# Altium schematic sheet Sheet1.SchDoc
size 420 x 297 mm; Address1: Address1; Address2: Address2; Address3: Address3; Address4: Address4; SheetNumber: 1; Scale: 1:1; Разраб.: Иванов; Обозначение документа: АБВГ.123456.001 Э3; Пров.: Петров; Утв.: Сидоров; Наименование организации: ОАО "Концерн "МПО-Гидроприбор"; Перв. применение: АБВГ.123456.000; Наименование изделия 1: Плата; Наименование изделия 2: Схема электрическая; Наименование изделия 3: принципиальная; Нач. отд.: Нач. отд.; Фамилия нач. отд.: Сидоров
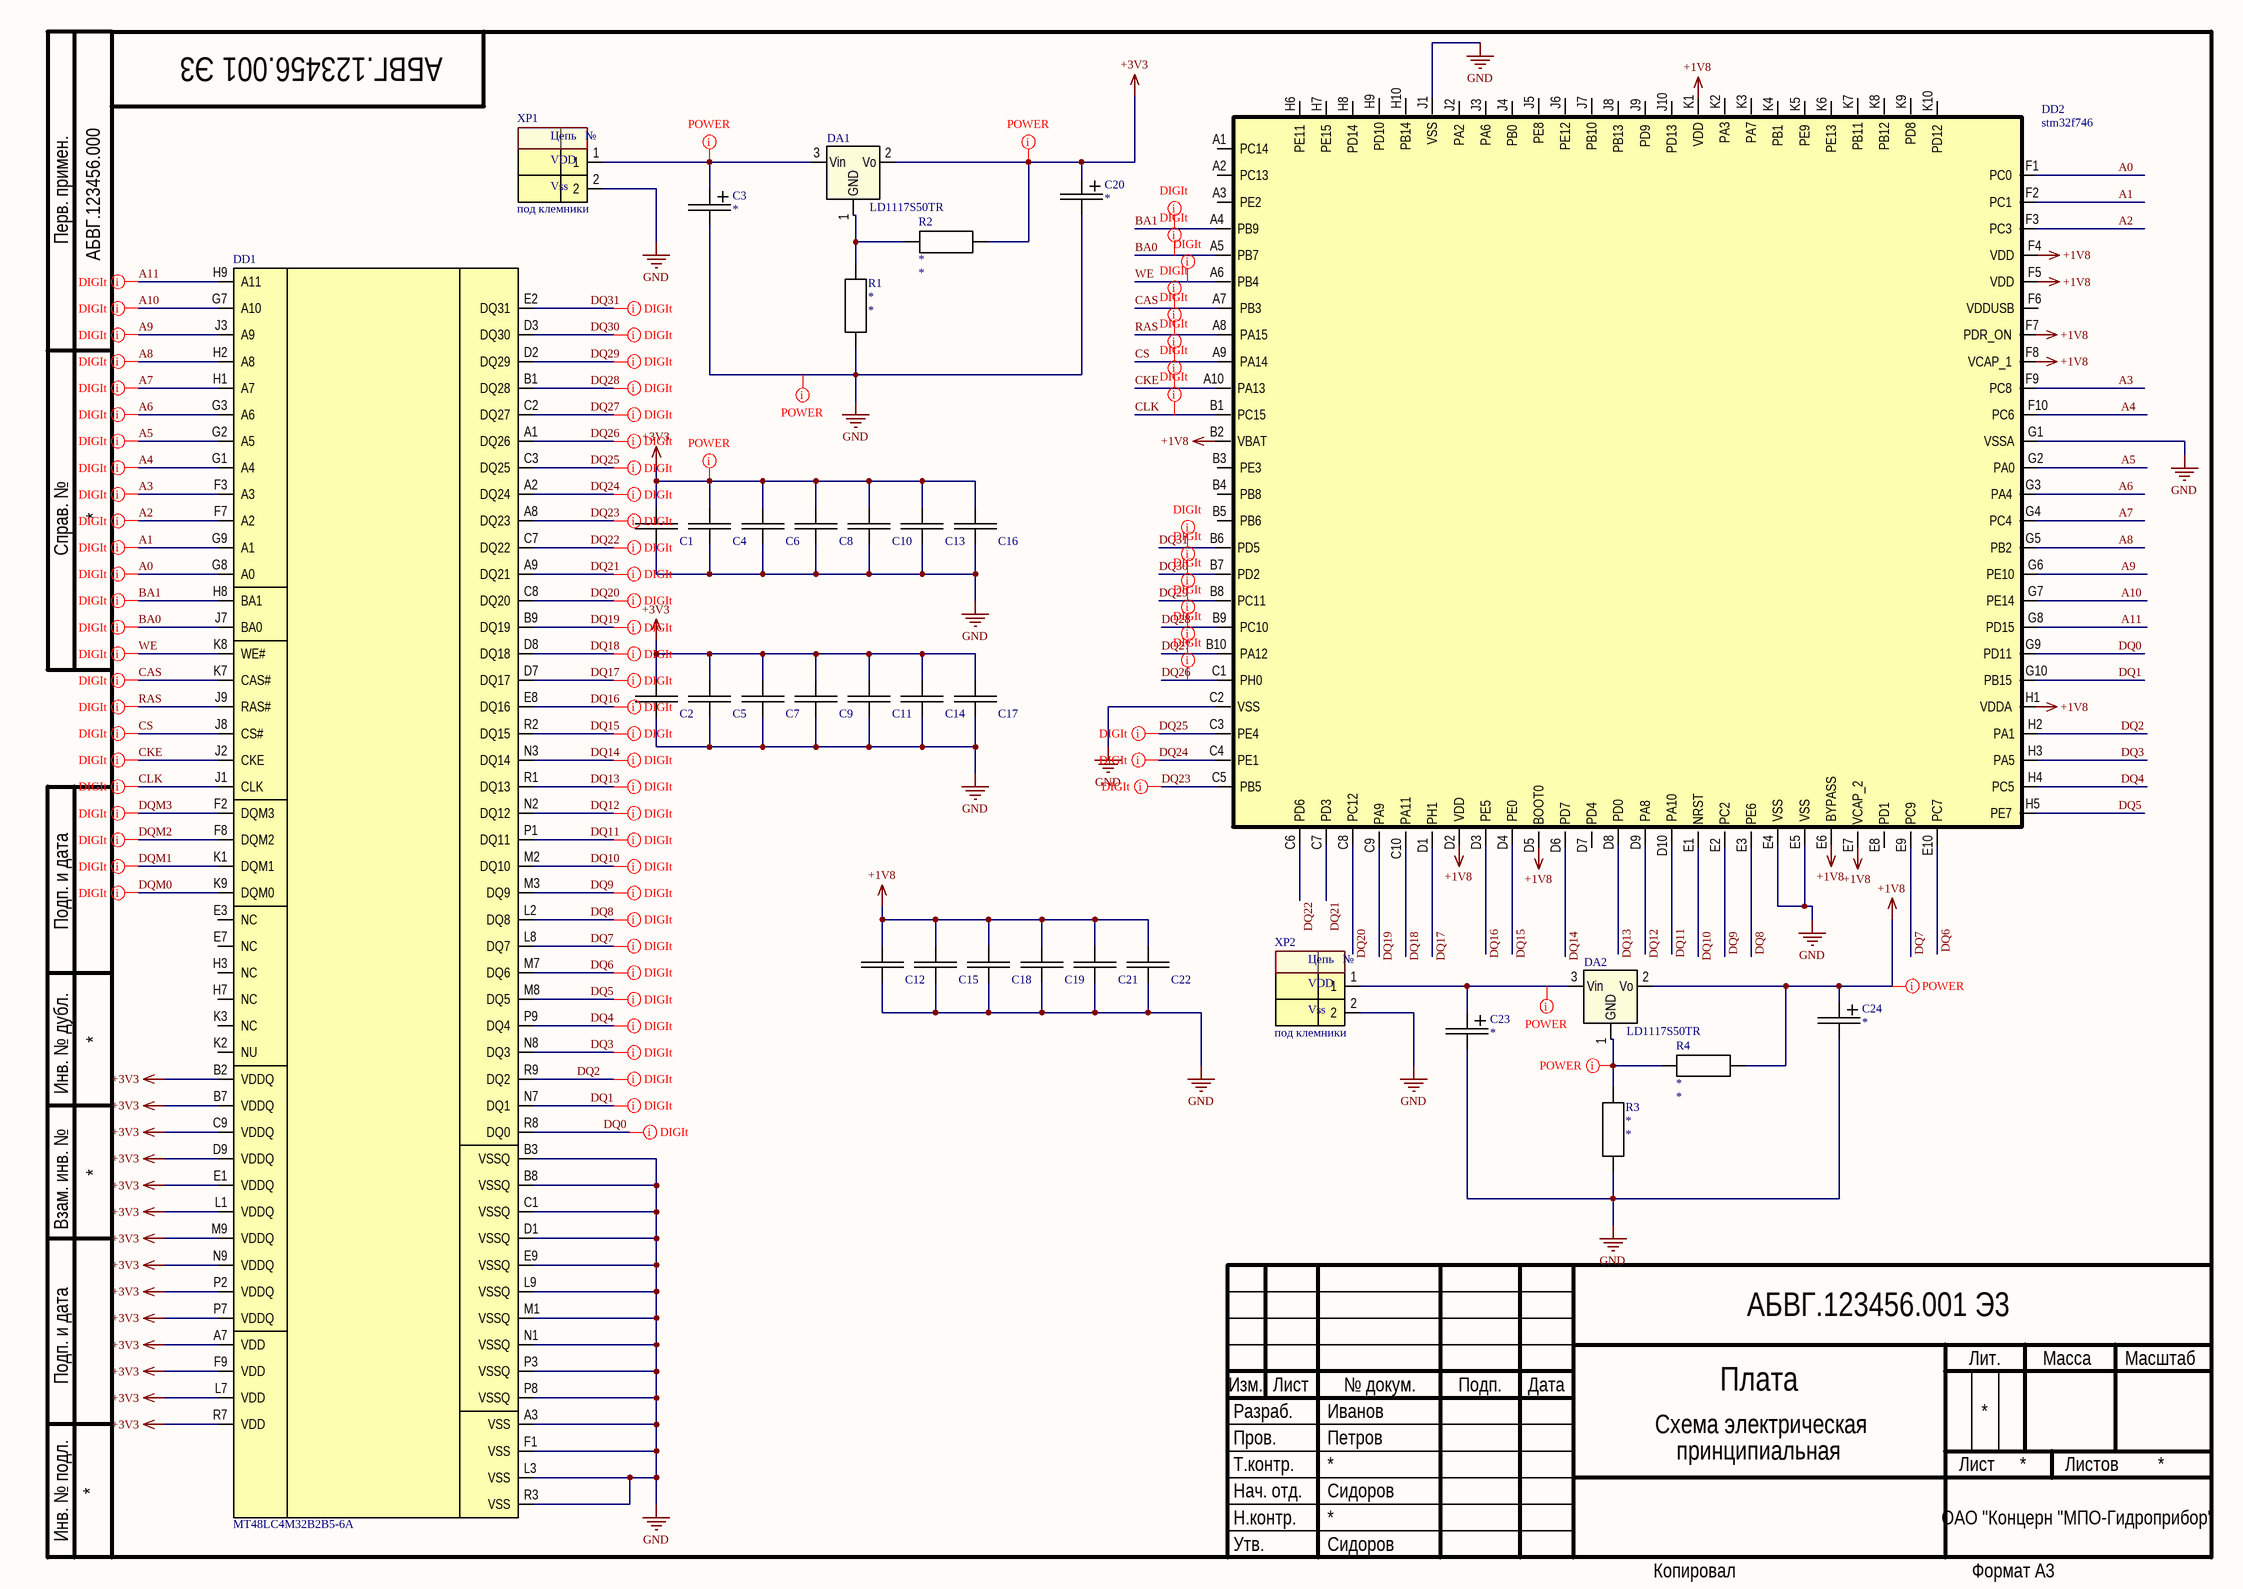
[diagram p0: Sheet1.SchDoc]

## Parts
C1  *  [CAP0402_min]  (value not drawn)
C2  *  [CAP0402_min]  (value not drawn)
C3  *  [Capasitor Tantal TypeA MIN]
C4  *  [CAP0402_min]  (value not drawn)
C5  *  [CAP0402_min]  (value not drawn)
C6  *  [CAP0402_min]  (value not drawn)
C7  *  [CAP0402_min]  (value not drawn)
C8  *  [CAP0402_min]  (value not drawn)
C9  *  [CAP0402_min]  (value not drawn)
C10  *  [CAP0402_min]  (value not drawn)
C11  *  [CAP0402_min]  (value not drawn)
C12  *  [CAP0402_min]  (value not drawn)
C13  *  [CAP0402_min]  (value not drawn)
C14  *  [CAP0402_min]  (value not drawn)
C15  *  [CAP0402_min]  (value not drawn)
C16  *  [CAP0402_min]  (value not drawn)
C17  *  [CAP0402_min]  (value not drawn)
C18  *  [CAP0402_min]  (value not drawn)
C19  *  [CAP0402_min]  (value not drawn)
C20  *  [Capasitor Tantal TypeA MIN]
C21  *  [CAP0402_min]  (value not drawn)
C22  *  [CAP0402_min]  (value not drawn)
C23  *  [Capasitor Tantal TypeA MIN]
C24  *  [Capasitor Tantal TypeA MIN]
DA1  LD1117S50TR  [SOD-223]
DA2  LD1117S50TR  [SOD-223]
DD1  MT48LC4M32B2B5-6A  [VFBGA90]
DD2  stm32f746  [BGA100P9X9-81A]
R1  *  [0402]
R2  *  [0402]
R3  *  [0402]
R4  *  [0402]
XP1  под клемники  [KLS2-EDR-500-2P]
XP2  под клемники  [KLS2-EDR-500-2P]

## Nets
+1V8: C12.1 C15.1 C18.1 C19.1 C21.1 C22.1 C24.1 DA2.2(Vo) DD2.B2(VBAT) DD2.D2(VDD) DD2.D5(BOOT0) DD2.E6(BYPASS) DD2.E7(VCAP_2) DD2.F4(VDD) DD2.F5(VDD) DD2.F7(PDR_ON) DD2.F8(VCAP_1) DD2.H1(VDDA) DD2.K1(VDD) R4.1
+3V3: C1.1 C2.1 C4.1 C5.1 C6.1 C7.1 C8.1 C9.1 C10.1 C11.1 C13.1 C14.1 C16.1 C17.1 C20.1 DA1.2(Vo) DD1.A7(VDD) DD1.B2(VDDQ) DD1.B7(VDDQ) DD1.C9(VDDQ) DD1.D9(VDDQ) DD1.E1(VDDQ) DD1.F9(VDD) DD1.L1(VDDQ) DD1.L7(VDD) DD1.M9(VDDQ) DD1.N9(VDDQ) DD1.P2(VDDQ) DD1.P7(VDDQ) DD1.R7(VDD) R2.1
GND: C1.2 C2.2 C3.2 C4.2 C5.2 C6.2 C7.2 C8.2 C9.2 C10.2 C11.2 C12.2 C13.2 C14.2 C15.2 C16.2 C17.2 C18.2 C19.2 C20.2 C21.2 C22.2 C23.2 C24.2 DD1.A3(VSS) DD1.B3(VSSQ) DD1.B8(VSSQ) DD1.C1(VSSQ) DD1.D1(VSSQ) DD1.E9(VSSQ) DD1.F1(VSS) DD1.L3(VSS) DD1.L9(VSSQ) DD1.M1(VSSQ) DD1.N1(VSSQ) DD1.P3(VSSQ) DD1.P8(VSSQ) DD1.R3(VSS) DD2.C2(VSS) DD2.E4(VSS) DD2.E5(VSS) DD2.G1(VSSA) DD2.J1(VSS) R1.1 R3.1 XP1.2 XP2.2
A0: DD1.G8(A0) DD2.F1(PC0)
A1: DD1.G9(A1) DD2.F2(PC1)
A2: DD1.F7(A2) DD2.F3(PC3)
A3: DD1.F3(A3) DD2.F9(PC8)
A4: DD1.G1(A4) DD2.F10(PC6)
A5: DD1.G2(A5) DD2.G2(PA0)
A6: DD1.G3(A6) DD2.G3(PA4)
A7: DD1.H1(A7) DD2.G4(PC4)
A8: DD1.H2(A8) DD2.G5(PB2)
A9: DD1.J3(A9) DD2.G6(PE10)
A10: DD1.G7(A10) DD2.G7(PE14)
A11: DD1.H9(A11) DD2.G8(PD15)
BA0: DD1.J7(BA0) DD2.A5(PB7)
BA1: DD1.H8(BA1) DD2.A4(PB9)
CAS: DD1.K7(CAS#) DD2.A7(PB3)
CKE: DD1.J2(CKE) DD2.A10(PA13)
CLK: DD1.J1(CLK) DD2.B1(PC15)
CS: DD1.J8(CS#) DD2.A9(PA14)
DQ0: DD1.R8(DQ0) DD2.G9(PD11)
DQ1: DD1.N7(DQ1) DD2.G10(PB15)
DQ2: DD1.R9(DQ2) DD2.H2(PA1)
DQ3: DD1.N8(DQ3) DD2.H3(PA5)
DQ4: DD1.P9(DQ4) DD2.H4(PC5)
DQ5: DD1.M8(DQ5) DD2.H5(PE7)
DQ6: DD1.M7(DQ6) DD2.E10(PC7)
DQ7: DD1.L8(DQ7) DD2.E9(PC9)
DQ8: DD1.L2(DQ8) DD2.E3(PE6)
DQ9: DD1.M3(DQ9) DD2.E2(PC2)
DQ10: DD1.M2(DQ10) DD2.E1(NRST)
DQ11: DD1.P1(DQ11) DD2.D10(PA10)
DQ12: DD1.N2(DQ12) DD2.D9(PA8)
DQ13: DD1.R1(DQ13) DD2.D8(PD0)
DQ14: DD1.N3(DQ14) DD2.D6(PD7)
DQ15: DD1.R2(DQ15) DD2.D4(PE0)
DQ16: DD1.E8(DQ16) DD2.D3(PE5)
DQ17: DD1.D7(DQ17) DD2.D1(PH1)
DQ18: DD1.D8(DQ18) DD2.C10(PA11)
DQ19: DD1.B9(DQ19) DD2.C9(PA9)
DQ20: DD1.C8(DQ20) DD2.C8(PC12)
DQ21: DD1.A9(DQ21) DD2.C7(PD3)
DQ22: DD1.C7(DQ22) DD2.C6(PD6)
DQ23: DD1.A8(DQ23) DD2.C5(PB5)
DQ24: DD1.A2(DQ24) DD2.C4(PE1)
DQ25: DD1.C3(DQ25) DD2.C3(PE4)
DQ26: DD1.A1(DQ26) DD2.C1(PH0)
DQ27: DD1.C2(DQ27) DD2.B10(PA12)
DQ28: DD1.B1(DQ28) DD2.B9(PC10)
DQ29: DD1.D2(DQ29) DD2.B8(PC11)
DQ30: DD1.D3(DQ30) DD2.B7(PD2)
DQ31: DD1.E2(DQ31) DD2.B6(PD5)
DQM0: DD1.K9(DQM0)
DQM1: DD1.K1(DQM1)
DQM2: DD1.F8(DQM2)
DQM3: DD1.F2(DQM3)
RAS: DD1.J9(RAS#) DD2.A8(PA15)
WE: DD1.K8(WE#) DD2.A6(PB4)
NetC3_1: C3.1 DA1.3(Vin) XP1.1
NetC23_1: C23.1 DA2.3(Vin) XP2.1
NetDA1_1: DA1.1(GND) R1.2 R2.2
NetDA2_1: DA2.1(GND) R3.2 R4.2

Not connected (* = marked no-connect by the designer): DD1 E3(NC) E7(NC) H3(NC) H7(NC) K2(NU) K3(NC); DD2 A1(PC14) A2(PC13) A3(PE2) B3(PE3) B4(PB8) B5(PB6) D7(PD4) E8(PD1) F6(VDDUSB) H6(PE11) H7(PE15) H8(PD14) H9(PD10) H10(PB14) J2(PA2) J3(PA6) J4(PB0) J5(PE8) J6(PE12) J7(PB10) J8(PB13) J9(PD9) J10(PD13) K2(PA3) K3(PA7) K4(PB1) K5(PE9) K6(PE13) K7(PB11) K8(PB12) K9(PD8) K10(PD12)

## Layout directives
net class Power: +1V8, +3V3, GND, NetC3_1, NetC23_1, NetDA2_1
net class DIGIt: A0, A1, A2, A3, A4, A5, A6, A7, A8, A9, A10, A11, BA0, BA1, CAS, CKE, CLK, CS, DQ0, DQ1, DQ2, DQ3, DQ4, DQ5, DQ6, DQ7, DQ8, DQ9, DQ10, DQ11, DQ12, DQ13, DQ14, DQ15, DQ16, DQ17, DQ18, DQ19, DQ20, DQ21, DQ22, DQ23, DQ24, DQ25, DQ26, DQ27, DQ28, DQ29, DQ30, DQ31, DQM0, DQM1, DQM2, DQM3, RAS, WE

## Notes on the sheet
- Перв. примен.
- Справ. №
- Подп. и дата
- Инв. № дубл.
- Взам. инв. №
- Разраб.
- Изм.
- Лист
- № докум.
- Подп.
- Дата
- Лит.
- Масса
- Масштаб
- Пров.
- Т.контр.
- Листов
- Инв. № подл.
- Утв.
- Н.контр.
- Копировал
- Формат А3
- (in symbol Connector_Power) Цепь; №; VDD; Vss

## Library data of the parts
C1 C2 C4-C19 C21 C22 = Capasitor: Value: *; Voltage: *; Part Number: *; Quantity: *; Package: *; Price: *; Manufacturer: *; ShoppingPlace: *
C3 C20 C23 C24 = Capasitor Electrolit: Part Namber: *; Value: *; Manufacturer: *; Price: *; ShoppingPlace: *; Power: *; Package: *
DA1 DA2 = LD1117S50TR: Manufacturer: Texas Instruments; Value: 3V; Part Number: LD1117S50TR; Quantity: 1; Package: SOT-23-6; Price: 1.58
DD1 = mt48lc4m32b2b5-6a: Manufacturer: MICRON; Part Number: MT48LC4M32B2B5-6A; Price: 10; Package: VBGA90; Quantity: 1; Documantation: https://www.micron.com/parts/dram/sdram/mt48lc4m32b2b5-6a-it
DD2 = stm32f746: Manufacturer: STM; Part Number: stm32f746; Package: LQFP48; Quantity: 1
R1-R4 = Resistor: Manufacturer: *; Quntity: *; Price: *; Part Number: *; Package: *; Value: *; Power: *
XP1 XP2 = Connector_Power: Package: *; Part Number: *; Value: *; Quantity: *; Price: *